# EAGLE design high_side_driver_fix (EAGLE 6.5.0)
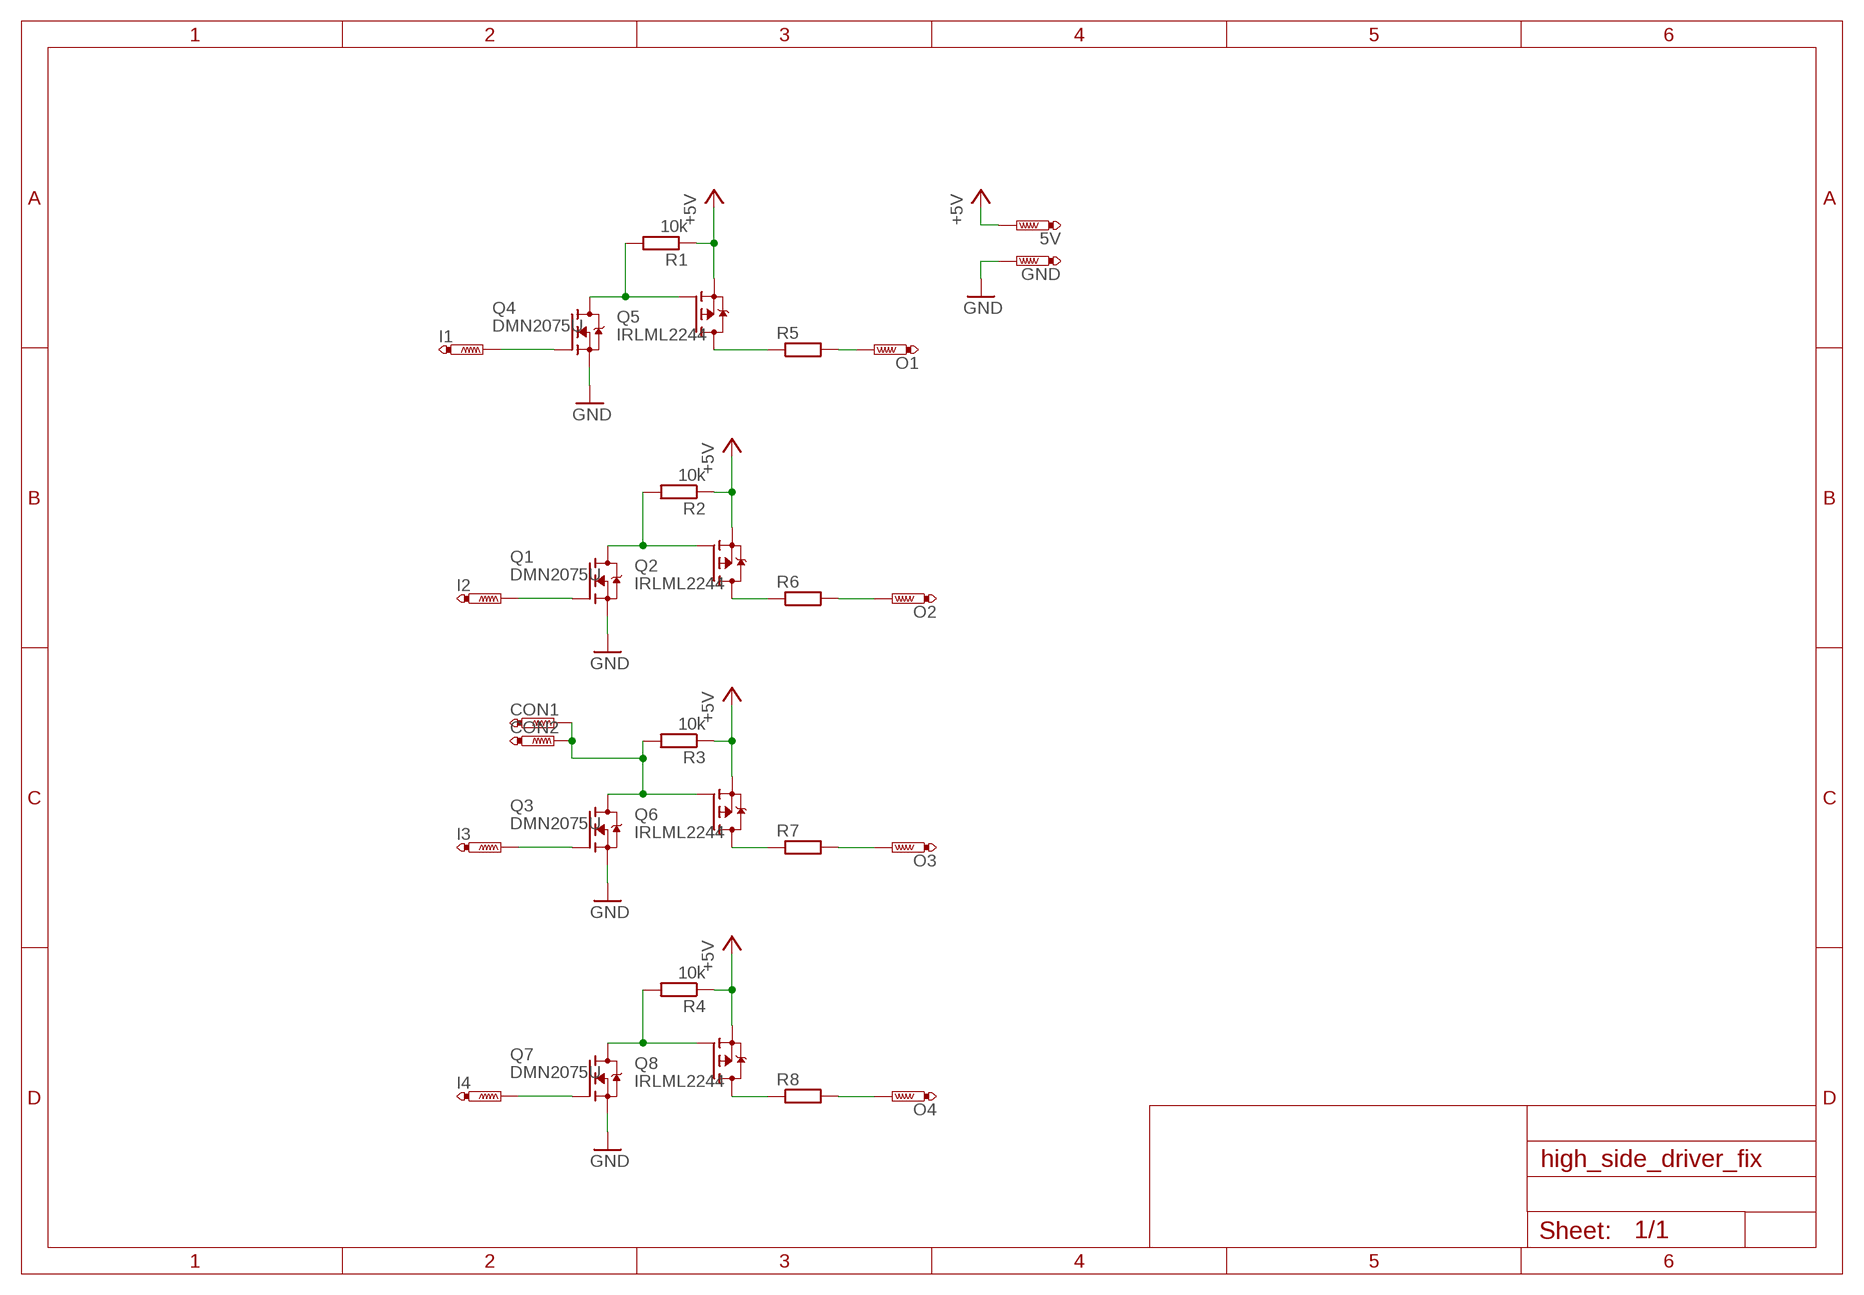
[diagram p0: schematic, sheet 1]

## Parts
5V  PTR1TP11SQ  [TP11SQ]
CON1  PTR1TP08SQ  [TP08SQ]
CON2  PTR1TP08SQ  [TP08SQ]
GND  PTR1TP11SQ  [TP11SQ]
I1  PTR1TP11SQ  [TP11SQ]
I2  PTR1TP11SQ  [TP11SQ]
I3  PTR1TP11SQ  [TP11SQ]
I4  PTR1TP11SQ  [TP11SQ]
O1  PTR1TP11SQ  [TP11SQ]
O2  PTR1TP11SQ  [TP11SQ]
O3  PTR1TP11SQ  [TP11SQ]
O4  PTR1TP11SQ  [TP11SQ]
Q1  DMN2075U  [SOT95P240X112-3N]
Q2  IRLML2244  [SOT95P240X112-3N]
Q3  DMN2075U  [SOT95P240X112-3N]
Q4  DMN2075U  [SOT95P240X112-3N]
Q5  IRLML2244  [SOT95P240X112-3N]
Q6  IRLML2244  [SOT95P240X112-3N]
Q7  DMN2075U  [SOT95P240X112-3N]
Q8  IRLML2244  [SOT95P240X112-3N]
R1  10k  R-EU_R0603  [R0603]
R2  10k  R-EU_R0603  [R0603]
R3  10k  R-EU_R0603  [R0603]
R4  10k  R-EU_R0603  [R0603]
R5  R-EU_M0805  [M0805]
R6  R-EU_M0805  [M0805]
R7  R-EU_M0805  [M0805]
R8  R-EU_M0805  [M0805]

## Nets
+5V: 5V.TP Q2.S Q5.S Q6.S Q8.S R1.1 R2.1 R3.1 R4.1
GND: GND.TP Q1.S Q3.S Q4.S Q7.S
N$1: Q4.D Q5.G R1.2
N$2: I1.TP Q4.G
N$3: Q5.D R5.1
N$4: Q1.D Q2.G R2.2
N$5: I2.TP Q1.G
N$6: O2.TP R6.2
N$7: CON1.TP CON2.TP Q3.D Q6.G R3.2
N$8: I3.TP Q3.G
N$9: O3.TP R7.2
N$10: Q7.D Q8.G R4.2
N$11: I4.TP Q7.G
N$12: O4.TP R8.2
N$13: Q8.D R8.1
N$14: Q6.D R7.1
N$15: Q2.D R6.1
N$16: O1.TP R5.2

## Library data of the parts
5V CON1 CON2 GND I1-I4 O1-O4 = testpad:PTR1: TEST PIN
Q1 Q3 Q4 Q7 = BEEP:DMN2075U
Q2 Q5 Q6 Q8 = BEEP:IRLML2244: OptiMOS(R)-P Small-Signal-Transistor P-Channel, Enhancement mode, Super Logic Level (2.5 V rated) Source: http://www.infineon.com/upload/Document/BSA223SP_Rev1.3.pdf
R1-R8 = rcl:R-EU_: RESISTOR, European symbol

## Board
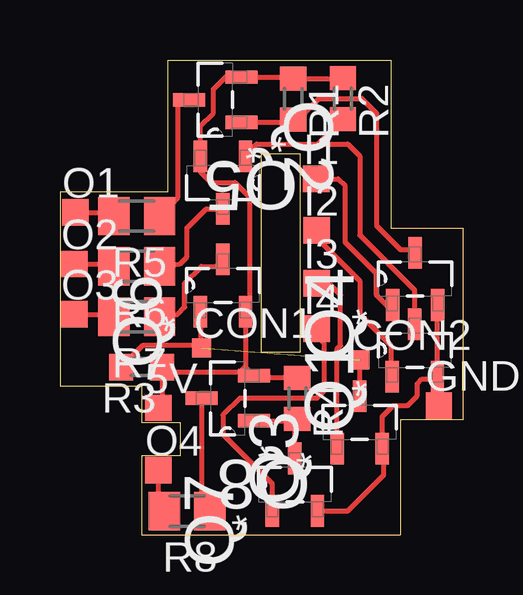
[diagram p1: board, top side]

Size 16.8 x 19.8 mm. Coordinates in mm from the lower left corner, seen from the top.
Outline: 4.5,14.3 4.5,19.8 13.8,19.8 13.8,12.8 16.8,12.8 16.8,4.79 14.2,4.79 14.2,0 3.4,0 3.4,3.29 5,3.29 5,4.69 3.4,4.69 3.4,6.2 0,6.2 0,14.3 4.5,14.3
Outline: 8.4,7.6 8.4,15.9 10,15.9 10,7.6 8.4,7.6
Copper layers (1*16): Top 0.035mm / dielectric 1.5mm / Bottom 0.035mm
Design rules "default *": minimum track width 8mil, minimum drill 24mil, track to track 8mil, track to pad 8mil, pad to pad 8mil, via to via 8mil, smd to smd 8mil, copper to edge 8mil, drill to drill 8mil, minimum pad ring 10mil, minimum via ring 8mil, stop-mask expansion 4mil, vias tented up to drill 0mil, thermal gap 10mil

### Footprints (pad centres in the part's own frame; a part is rotated, then mirrored left to right if it is on the bottom)
TP11SQ = smd 1.1 x 1.1: TP 0,0
TP08SQ = smd 0.8 x 0.8: TP 0,0
SOT95P240X112-3N = smd 1.321 x 0.559: D 1.092,0; G -1.092,0.94; S -1.092,-0.94
R0603 = smd 1 x 1.1: 1 -0.85,0; 2 0.85,0
M0805 = smd 1.3 x 1.6: 1 -0.95,0; 2 0.95,0

### Placement (x,y rotation side)
5V  4.1,5.29 0 top
CON1  5.9,7.79 0 top
CON2  12.5,7.29 0 top
GND  15.8,5.39 0 top
I1  10.69,14.84 0 top
I2  10.7,12.69 0 top
I3  10.7,10.49 0 top
I4  10.7,8.59 0 top
O1  0.64,13.44 0 top
O2  0.6,11.29 0 top
O3  0.6,9.19 0 top
O4  4.1,2.69 0 top
Q1  14.8,7.69 90 top
Q2  6.8,14.69 270 top
Q3  12.5,4.69 90 top
Q4  14.81,10.67 90 top
Q5  6.48,18.14 180 top
Q6  6.8,10.39 90 top
Q7  9.8,2.09 90 top
Q8  7,5.69 180 top
R1  9.73,18.17 270 top
R2  11.8,18.19 270 top
R3  3.4,6.99 180 top
R4  9.9,5.69 270 top
R5  3.2,13.29 180 top
R6  3.2,11.19 180 top
R7  3.2,9.09 180 top
R8  5.3,0.99 180 top

### Tracks (layer width: path | path; a pad name or v marks a point on that pad's centre or on a via)
+5V
  Top 0.203: 7.49,19.08 Q5.S | Q5.S 6.9,19.09 6.4,18.59 6.4,17.59 5.86,17.05 Q2.S 5.86,15.13 6.3,14.69 7.3,14.69 7.9,14.09 7.9,9.46 Q6.S 7.74,6.98 | Q5.S 9.7,19.09 R1.1 11.78,19.02 R2.1 | 11.72,19.12 R2.1 | R2.1 11.85,19.09 | R4.1 8.18,6.54 Q8.S | 5V.TP 4.25,5.44 R3.1 4.4,6.99 4.6,6.79 7.5,6.79 7.69,6.98 7.74,6.98 | Q8.S 8.06,6.63 | 7.74,6.98 Q8.S
GND
  Top 0.203: Q1.S 15.74,9.57 Q4.S | Q7.S 12.01,1 13.5,2.49 13.5,3.06 Q3.S 13.44,4.93 13.9,5.39 14.5,5.39 14.9,5.79 14.9,6.29 15.1,6.49 15.73,6.49 Q1.S | Q1.S 15.79,6.2 GND.TP
N$1
  Top 0.203: Q5.G 9.51,17.2 R1.2 9.95,17.2 9.95,17.34 10.8,18.19 12.6,18.19 13.2,17.59 13.2,12.89 14.2,11.89 14.68,11.89 Q4.D 14.71,11.86
N$2
  Top 0.203: I1.TP 11.6,14.84 11.9,14.54 11.9,12.19 13.2,10.89 13.2,9.99 13.61,9.58 Q4.G
N$3
  Top 0.203: Q5.D 5.15,18.14 4.9,17.89 4.9,14.04 R5.1
N$4
  Top 0.203: Q2.G 7.74,15.93 7.84,15.93 8.2,16.29 10.75,16.29 | 10.75,16.29 R2.2 | 10.75,16.29 12,16.29 12.5,15.79 12.5,12.49 14.8,10.19 Q1.D
N$5
  Top 0.203: I2.TP 10.7,12.39 12.5,10.59 12.5,9.19 13.8,7.89 13.8,6.56 Q1.G
N$6
  Top 0.203: O2.TP 2.15,11.29 R6.2
N$7  (1 unrouted)
  Top 0.203: Q6.G 5.86,8.03 | R3.2 3.45,7.89 5.8,7.89 5.86,7.95 5.86,8.03 | 5.86,8.03 CON1.TP | Q3.D CON2.TP
N$8
  Top 0.203: I3.TP 11.2,10.49 11.7,9.99 11.7,7.89 11.56,7.75 Q3.G
N$9
  Top 0.203: O3.TP 2.15,9.19 R7.2
N$10
  Top 0.203: 9.75,4.49 R4.2 | Q8.G 9.81,4.75 R4.2 | Q7.D 9.8,4.74 R4.2
N$11
  Top 0.203: Q7.G 8.86,2.13 6.8,4.19 6.8,4.99 7.5,5.69 10.7,5.69 11,5.99 11,7.99 10.7,8.29 I4.TP
N$12
  Top 0.203: O4.TP 4.1,1.24 R8.2
N$13
  Top 0.203: Q8.D 5.91,1.33 R8.1
N$14
  Top 0.203: R7.1 4.9,9.19 5.2,9.49 5.2,10.49 5.9,11.19 6.51,11.19 Q6.D
N$15
  Top 0.203: R6.1 5,11.29 5.3,11.59 5.3,12.79 6.1,13.59 Q2.D
N$16
  Top 0.203: O1.TP 2.1,13.44 R5.2